# Altium schematic sheet ADC.SchDoc
size A4; DocumentNumber: 1; SheetNumber: 5; SheetTotal: 5
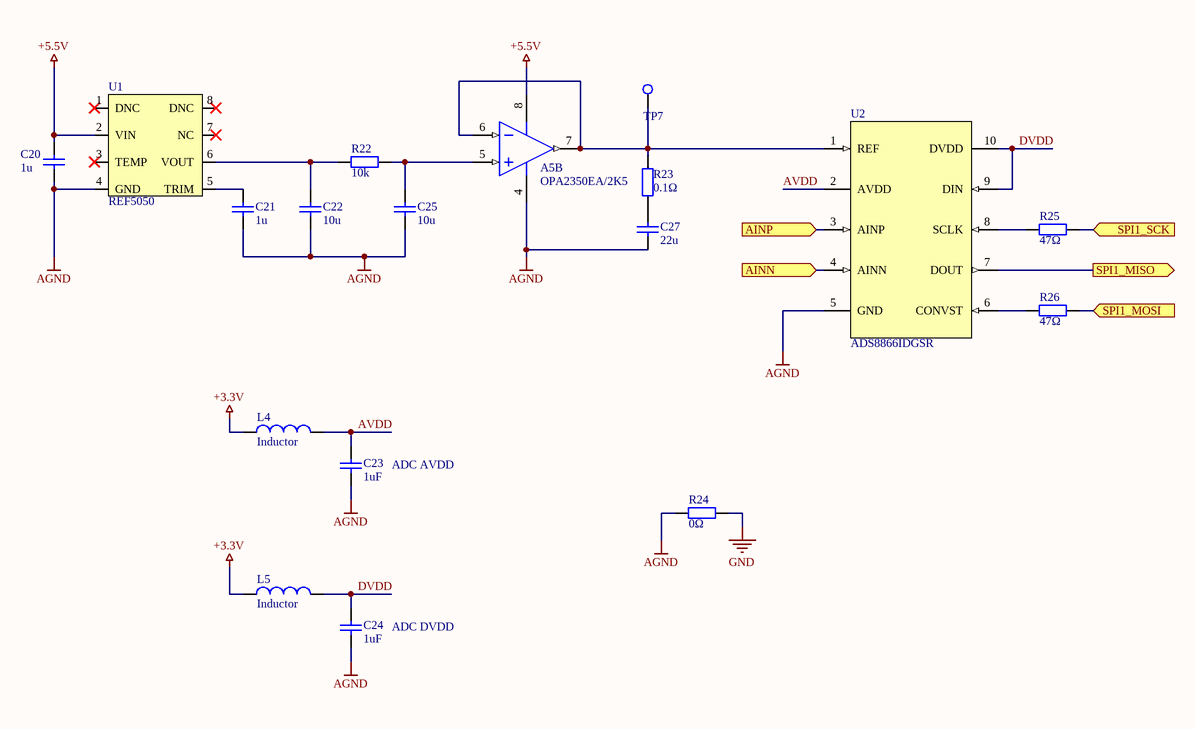
[diagram p0: ADC.SchDoc]

## Parts
A5  OPA2350EA/2K5  [SOIC127P600X175-8N]  (part B of 2)
C20  1u  [CAPC1608X87N]
C21  1u  [CAPC1608X87N]
C22  10u  [CAPC2012X110N]
C23  1uF  [CAPC1608X87N]
C24  1uF  [CAPC1608X87N]
C25  10u  [CAPC2012X110N]
C27  22u  [CAPC2012X110N]
L4  Inductor  [RESC1608X55N]
L5  Inductor  [INDC1608L]
R22  10k  [RESC1608X55N]
R23  0.1Ω  [RESC1608X55N]
R24  0Ω  [RESC1608X55N]
R25  47Ω  [RESC1608X55N]
R26  47Ω  [RESC1608X55N]
TP7  TP  [TEST-POINT]  (value not drawn)  (no BOM)
U1  REF5050  [SOIC127P600X175-8N]
U2  ADS8866IDGSR  [SOP50P490X110-10N]

## Ports
AINN (in), AINP (in), SPI1_MISO (out), SPI1_MOSI (in), SPI1_SCK (in)

## Nets
+3.3V: L4.1 L5.1
+5.5V: A5.8(V+) C20.2 U1.2(VIN)
AGND: A5.4(V-) C20.1 C21.1 C22.1 C23.1 C24.1 C25.1 C27.2 R24.1 U1.4(GND) U2.5(GND)
GND: R24.2
AINN: U2.4(AINN) ; port AINN
AINP: U2.3(AINP) ; port AINP
AVDD: C23.2 L4.2 U2.2(AVDD)
DVDD: C24.2 L5.2 U2.9(DIN) U2.10(DVDD)
SPI1_MISO: U2.7(DOUT) ; port SPI1_MISO
SPI1_MOSI: R26.2 ; port SPI1_MOSI
SPI1_SCK: R25.2 ; port SPI1_SCK
NetA5_5: A5.5(IN_B+) C25.2 R22.2
NetA5_6: A5.6(IN_B-) A5.7(OUT_B) R23.2 TP7.0 U2.1(REF)
NetC21_2: C21.2 U1.5(TRIM)
NetC22_2: C22.2 R22.1 U1.6(VOUT)
NetC27_1: C27.1 R23.1
NetR25_1: R25.1 U2.8(SCLK)
NetR26_1: R26.1 U2.6(CONVST)

Not connected (* = marked no-connect by the designer): U1 1(DNC)* 3(TEMP)* 7(NC)* 8(DNC)*

## Notes on the sheet
- (near C23) ADC AVDD
- (near C24) ADC DVDD

## Library data of the parts
A5 = OPA2350EA/250: Manufacturer 1: Texas Instruments; Manufacturer Part Number 1: OPA2350EA/2K5
C20 C21 C23 C24 = Cap: Manufacturer 1: Taiyo Yuden; Manufacturer Part Number 1: EMK107BJ105KA-T
C22 C25 C27 = Cap: Manufacturer 1: Taiyo Yuden; Manufacturer Part Number 1: EMK212BB7106KG-T
R22 = Res2: Manufacturer 1: Yageo; Manufacturer Part Number 1: RC0603FR-0710KL; MOUSER Part Number: 603-RC0603FR-0710KL
R23 = Res2: Manufacturer 1: Wurth Elektronik; Manufacturer Part Number 1: 560050316001
R24 = Res2: Manufacturer 1: Panasonic; Manufacturer Part Number 1: ERJ-3GEY0R00V
R25 R26 = Res2: Manufacturer 1: Vishay/Dale; Manufacturer Part Number 1: CRCW060347R0JNEAC
TP7 = TEST_POINT: Generic test point
U1 = REF5050: Manufacturer 1: Texas Instruments; Manufacturer Part Number 1: REF5050AIDR
U2 = AD8866: Manufacturer 1: Texas Instruments; Manufacturer Part Number 1: ADS8866IDGSR
L4 L5 = Inductor
  L4: Manufacturer 1: *; Manufacturer Part Number 1: *